# Altium project FMC_Test_Module.PrjPcb
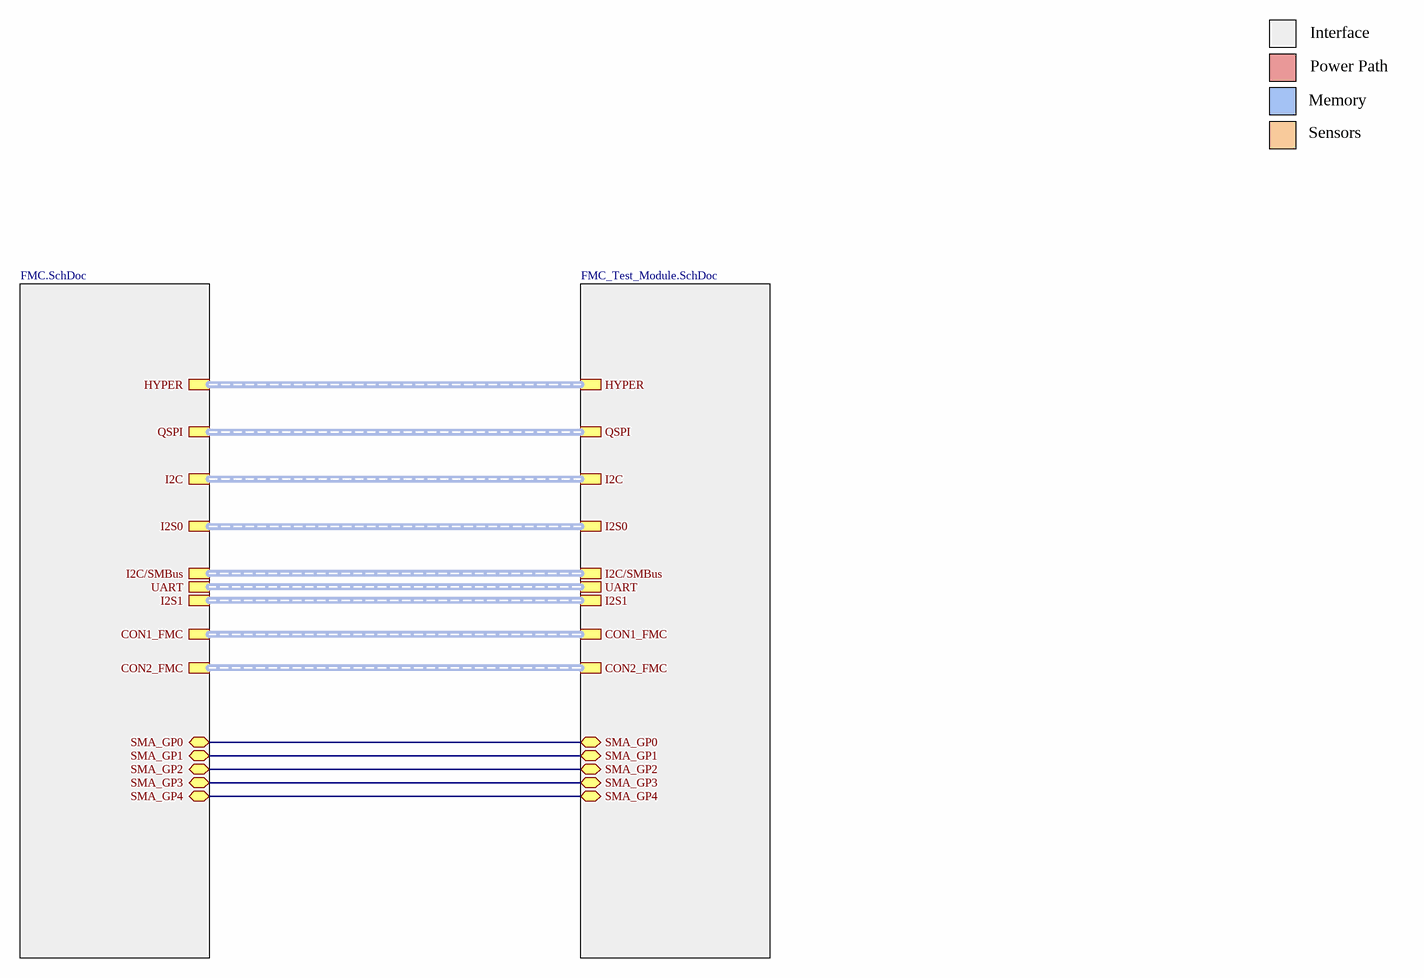
[diagram p0: FMC_Test_Module_main.SchDoc]
author: Philipp Mayer; institute: Integrated Systems Laboratory; organization: ETH Zurich; productname: FMC Test Module; version: A
3 sheets, 11 parts. Net scope: hierarchical (ports join the sheet entries above them; power ports are global).
Board file: FMC_Test_Module.PcbDoc
Sheets:
  FMC_Test_Module_main.SchDoc
    FMC = FMC.SchDoc
    TEST = FMC_Test_Module.SchDoc

## Sheet FMC_Test_Module_main.SchDoc: FMC Test Module - Main
size A3; Author: mayerph; DrawnBy: mayerph; Organization: IIS; Revision: PA; SheetNumber: 1; SheetTotal: 3

### Sub-sheets
FMC = FMC.SchDoc: HYPER, QSPI, I2C, I2S0, I2C/SMBus, UART, I2S1, CON1_FMC, CON2_FMC, SMA_GP2 (bidir), SMA_GP3 (bidir), SMA_GP0 (bidir), SMA_GP1 (bidir), SMA_GP4 (bidir)
TEST = FMC_Test_Module.SchDoc: HYPER, QSPI, I2C, I2S0, I2C/SMBus, UART, I2S1, CON1_FMC, CON2_FMC, SMA_GP3 (bidir), SMA_GP4 (bidir), SMA_GP2 (bidir), SMA_GP0 (bidir), SMA_GP1 (bidir)

### Nets
NetJ1_1: sheet FMC/SMA_GP0, sheet TEST/SMA_GP0
NetJ2_1: sheet FMC/SMA_GP1, sheet TEST/SMA_GP1
NetJ3_1: sheet FMC/SMA_GP2, sheet TEST/SMA_GP2
NetJ4_1: sheet FMC/SMA_GP3, sheet TEST/SMA_GP3
NetJ5_1: sheet FMC/SMA_GP4, sheet TEST/SMA_GP4

### Buses and harness runs
harness sheet FMC/CON1_FMC = sheet TEST/CON1_FMC
harness sheet FMC/CON2_FMC = sheet TEST/CON2_FMC
harness sheet FMC/HYPER = sheet TEST/HYPER
harness sheet FMC/I2C = sheet TEST/I2C
harness sheet FMC/I2C/SMBus = sheet TEST/I2C/SMBus
harness sheet FMC/I2S0 = sheet TEST/I2S0
harness sheet FMC/I2S1 = sheet TEST/I2S1
harness sheet FMC/QSPI = sheet TEST/QSPI
harness sheet FMC/UART = sheet TEST/UART

### Notes on the sheet
- Interface
- Memory
- Power Path
- Sensors
- 1
- 2
- 3
- 4
- 5
- 6
- 7
- 8
- A
- B
- C
- D
- Project:
- Date:
- Drawing number:
- Rev:
- Format:
- A3
- Drawn by:
- Laboratory:
- Page
- Sheet:
- of
- File:

## Sheet FMC.SchDoc: FMC Test Module - FMC
size A3; Author: mayerph; DrawnBy: mayerph; Organization: IIS; Revision: PA; SheetNumber: 2; SheetTotal: 3
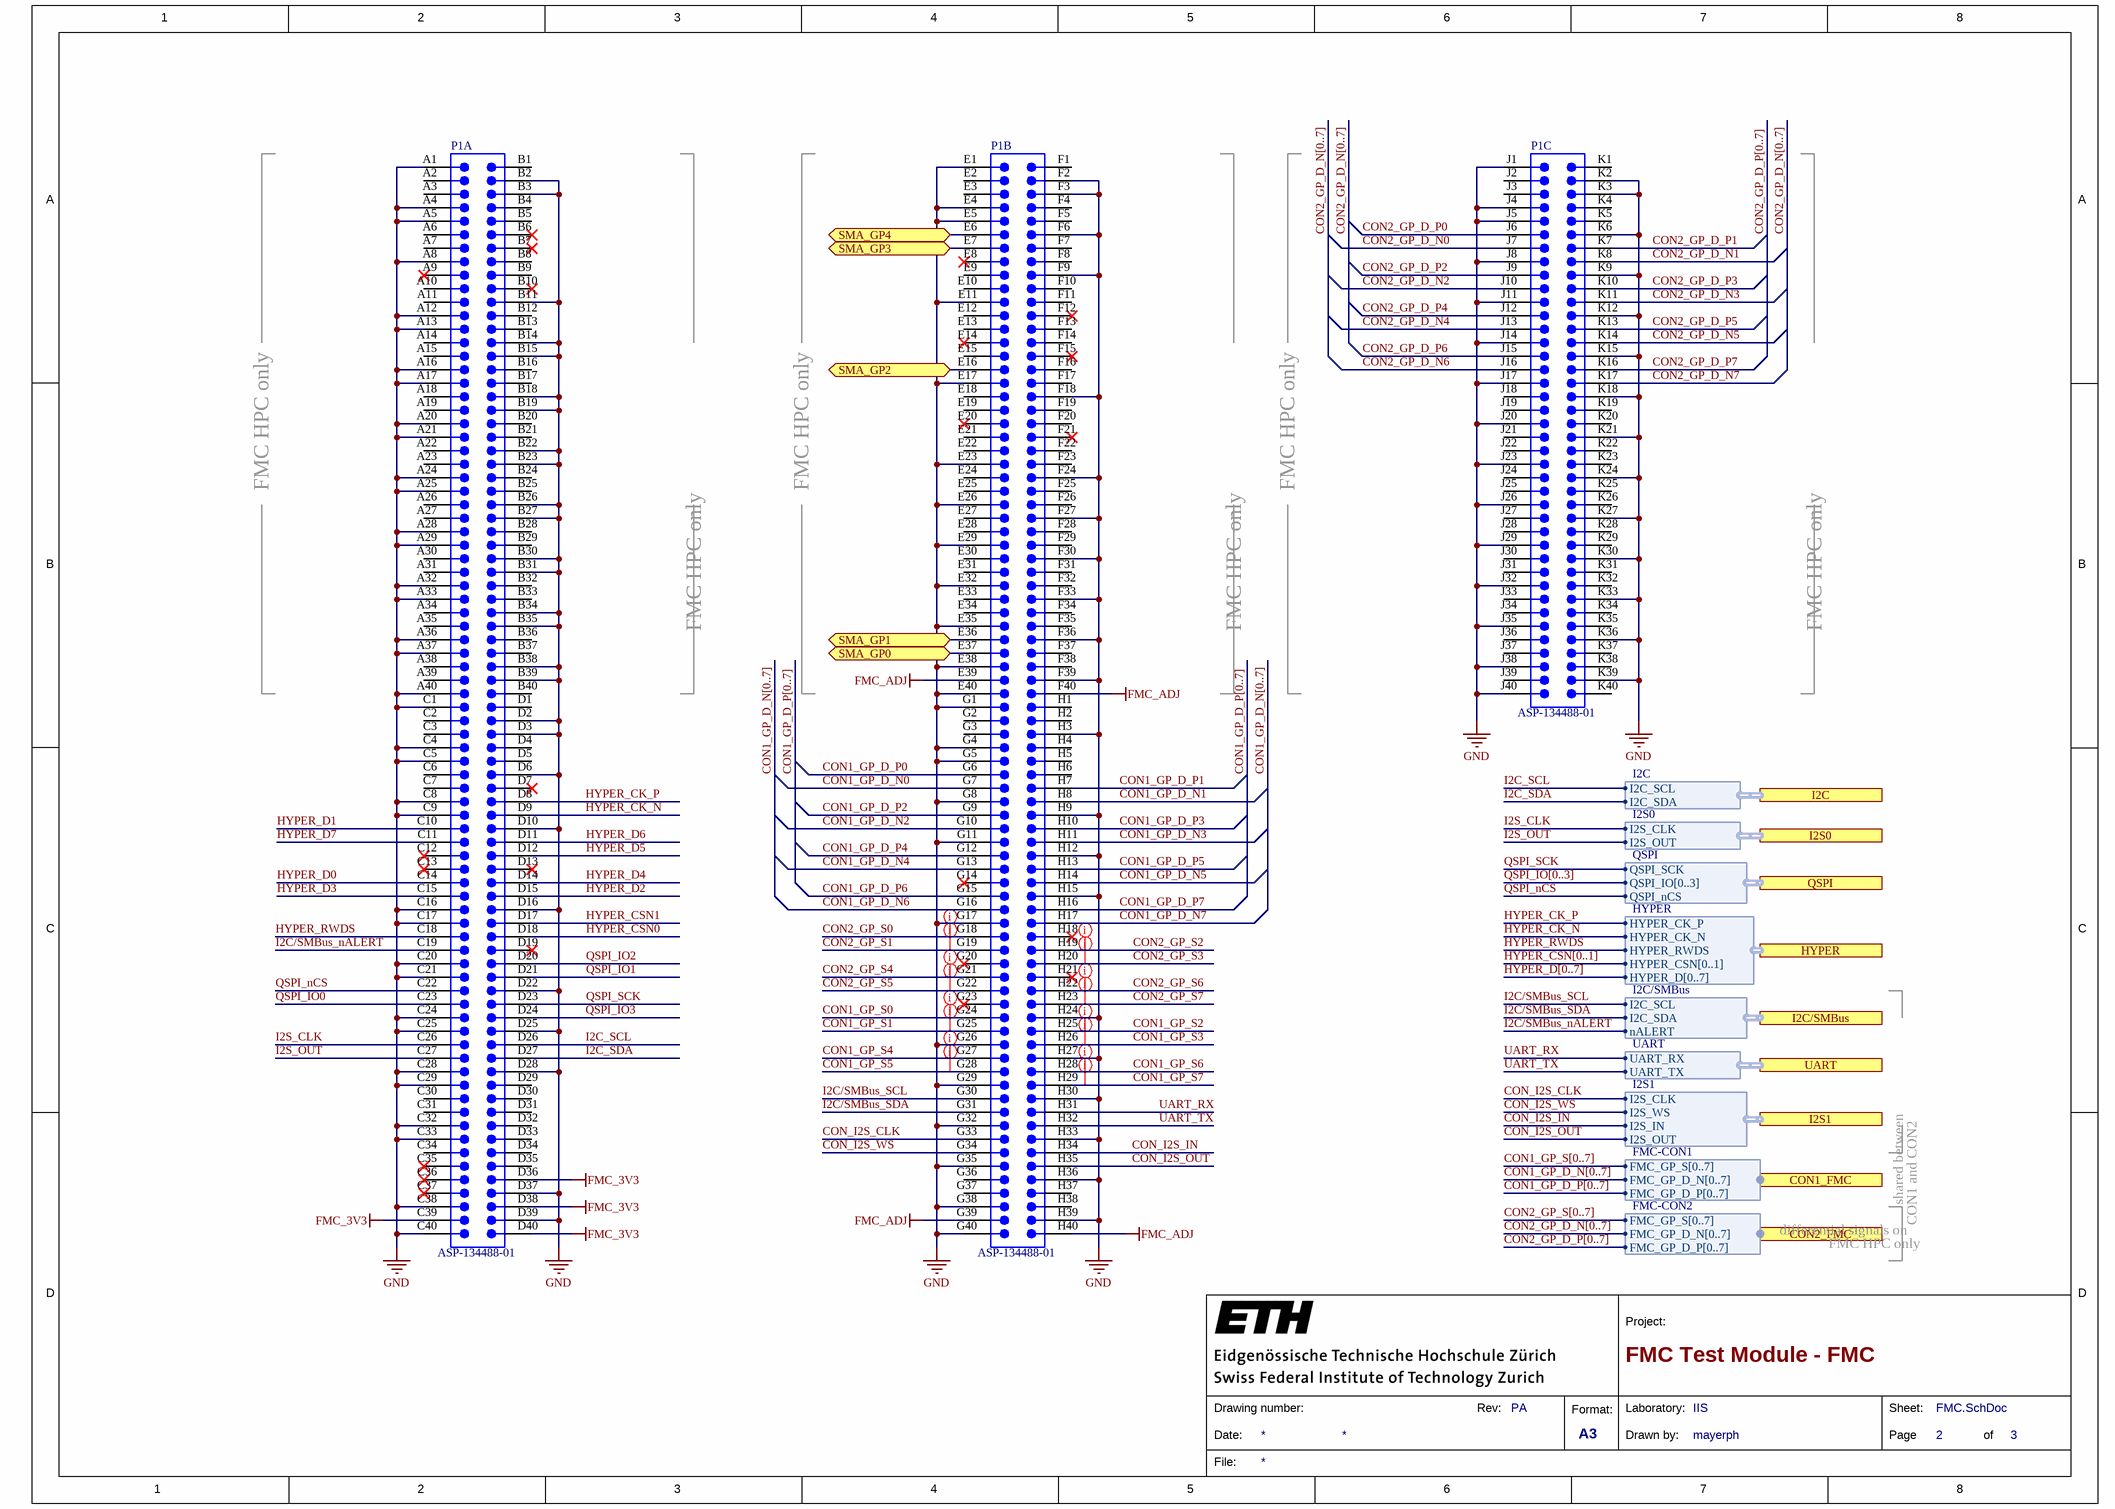
[diagram p1: FMC.SchDoc]

### Parts
P1  ASP-134488-01  [BTB-SM1-27-2V400M]  (parts A,B,C of 3)

### Ports
CON1_FMC (harness FMC-CON1), CON2_FMC (harness FMC-CON2), HYPER (harness HYPER), I2C (harness I2C), I2C/SMBus (harness I2C/SMBus), I2S0 (harness I2S0), I2S1 (harness I2S1), QSPI (harness QSPI), SMA_GP0 (bidir), SMA_GP1 (bidir), SMA_GP2 (bidir), SMA_GP3 (bidir), SMA_GP4 (bidir), UART (harness UART)

### Harnesses
I2C/SMBus: I2C_SDA, I2C_SCL, nALERT
UART: UART_TX, UART_RX
I2S1: I2S_OUT, I2S_IN, I2S_WS, I2S_CLK
FMC-CON1: FMC_GP_D_N[0..7], FMC_GP_S[0..7], FMC_GP_D_P[0..7]
I2S0: I2S_OUT, I2S_CLK
I2C: I2C_SDA, I2C_SCL
QSPI: QSPI_SCK, QSPI_IO[0..3], QSPI_nCS
HYPER: HYPER_CK_N, HYPER_CK_P, HYPER_RWDS, HYPER_CSN[0..1], HYPER_D[0..7]
FMC-CON2: FMC_GP_D_N[0..7], FMC_GP_S[0..7], FMC_GP_D_P[0..7]

### Nets
FMC_3V3: P1.C39 P1.D36 P1.D38 P1.D40
FMC_ADJ: P1.E39 P1.F40 P1.G39 P1.H40
GND: P1.A1 P1.A4 P1.A5 P1.A8 P1.A12 P1.A13 P1.A16 P1.A17 P1.A20 P1.A21 P1.A24 P1.A25 P1.A28 P1.A29 P1.A32 P1.A33 P1.A36 P1.A37 P1.A40 P1.B2 P1.B3 P1.B11 P1.B14 P1.B15 P1.B18 P1.B19 P1.B22 P1.B23 P1.B26 P1.B27 P1.B30 P1.B31 P1.B34 P1.B35 P1.B38 P1.B39 P1.C1 P1.C4 P1.C5 P1.C8 P1.C9 P1.C16 P1.C17 P1.C20 P1.C21 P1.C24 P1.C25 P1.C28 P1.C29 P1.C32 P1.C33 P1.C38 P1.C40 P1.D2 P1.D3 P1.D6 P1.D10 P1.D16 P1.D22 P1.D25 P1.D28 P1.D37 P1.D39 P1.E1 P1.E4 P1.E5 P1.E11 P1.E17 P1.E23 P1.E26 P1.E29 P1.E32 P1.E35 P1.E38 P1.E40 P1.F2 P1.F3 P1.F6 P1.F9 P1.F18 P1.F24 P1.F27 P1.F30 P1.F33 P1.F36 P1.F39 P1.G1 P1.G4 P1.G5 P1.G8 P1.G11 P1.G17 P1.G26 P1.G29 P1.G32 P1.G35 P1.G38 P1.G40 P1.H3 P1.H9 P1.H12 P1.H15 P1.H24 P1.H27 P1.H30 P1.H33 P1.H36 P1.H39 P1.J1 P1.J4 P1.J5 P1.J8 P1.J11 P1.J14 P1.J17 P1.J20 P1.J23 P1.J26 P1.J29 P1.J32 P1.J35 P1.J38 P1.J40 P1.K2 P1.K3 P1.K6 P1.K9 P1.K12 P1.K15 P1.K18 P1.K21 P1.K24 P1.K27 P1.K30 P1.K33 P1.K36 P1.K39
CON1_GP_D_N0: P1.G7
CON1_GP_D_N1: P1.H8
CON1_GP_D_N2: P1.G10
CON1_GP_D_N3: P1.H11
CON1_GP_D_N4: P1.G13
CON1_GP_D_N5: P1.H14
CON1_GP_D_N6: P1.G16
CON1_GP_D_N7: P1.H17
CON1_GP_D_P0: P1.G6
CON1_GP_D_P1: P1.H7
CON1_GP_D_P2: P1.G9
CON1_GP_D_P3: P1.H10
CON1_GP_D_P4: P1.G12
CON1_GP_D_P5: P1.H13
CON1_GP_D_P6: P1.G15
CON1_GP_D_P7: P1.H16
CON1_GP_S0: P1.G24
CON1_GP_S1: P1.G25
CON1_GP_S2: P1.H25
CON1_GP_S3: P1.H26
CON1_GP_S4: P1.G27
CON1_GP_S5: P1.G28
CON1_GP_S6: P1.H28
CON1_GP_S7: P1.H29
CON2_GP_D_N0: P1.J7
CON2_GP_D_N1: P1.K8
CON2_GP_D_N2: P1.J10
CON2_GP_D_N3: P1.K11
CON2_GP_D_N4: P1.J13
CON2_GP_D_N5: P1.K14
CON2_GP_D_N6: P1.J16
CON2_GP_D_N7: P1.K17
CON2_GP_D_P0: P1.J6
CON2_GP_D_P1: P1.K7
CON2_GP_D_P2: P1.J9
CON2_GP_D_P3: P1.K10
CON2_GP_D_P4: P1.J12
CON2_GP_D_P5: P1.K13
CON2_GP_D_P6: P1.J15
CON2_GP_D_P7: P1.K16
CON2_GP_S0: P1.G18
CON2_GP_S1: P1.G19
CON2_GP_S2: P1.H19
CON2_GP_S3: P1.H20
CON2_GP_S4: P1.G21
CON2_GP_S5: P1.G22
CON2_GP_S6: P1.H22
CON2_GP_S7: P1.H23
CON_I2S_CLK: P1.G33 ; port I2S1.I2S_CLK
CON_I2S_IN: P1.H34 ; port I2S1.I2S_IN
CON_I2S_OUT: P1.H35 ; port I2S1.I2S_OUT
CON_I2S_WS: P1.G34 ; port I2S1.I2S_WS
HYPER_CK_N: P1.D9 ; port HYPER.HYPER_CK_N
HYPER_CK_P: P1.D8 ; port HYPER.HYPER_CK_P
HYPER_CSN0: P1.D18
HYPER_CSN1: P1.D17
HYPER_D0: P1.C14
HYPER_D1: P1.C10
HYPER_D2: P1.D15
HYPER_D3: P1.C15
HYPER_D4: P1.D14
HYPER_D5: P1.D12
HYPER_D6: P1.D11
HYPER_D7: P1.C11
HYPER_RWDS: P1.C18 ; port HYPER.HYPER_RWDS
I2C/SMBus_nALERT: P1.C19 ; port I2C/SMBus.nALERT
I2C/SMBus_SCL: P1.G30 ; port I2C/SMBus.I2C_SCL
I2C/SMBus_SDA: P1.G31 ; port I2C/SMBus.I2C_SDA
I2C_SCL: P1.D26 ; port I2C.I2C_SCL
I2C_SDA: P1.D27 ; port I2C.I2C_SDA
I2S_CLK: P1.C26 ; port I2S0.I2S_CLK
I2S_OUT: P1.C27 ; port I2S0.I2S_OUT
QSPI_IO0: P1.C23
QSPI_IO1: P1.D21
QSPI_IO2: P1.D20
QSPI_IO3: P1.D24
QSPI_nCS: P1.C22 ; port QSPI.QSPI_nCS
QSPI_SCK: P1.D23 ; port QSPI.QSPI_SCK
UART_RX: P1.H31 ; port UART.UART_RX
UART_TX: P1.H32 ; port UART.UART_TX
NetJ1_1: P1.E37 ; port SMA_GP0
NetJ2_1: P1.E36 ; port SMA_GP1
NetJ3_1: P1.E16 ; port SMA_GP2
NetJ4_1: P1.E7 ; port SMA_GP3
NetJ5_1: P1.E6 ; port SMA_GP4

Not connected (* = marked no-connect by the designer): P1 A2 A3 A6 A7 A9* A10 A11 A14 A15 A18 A19 A22 A23 A26 A27 A30 A31 A34 A35 A38 A39 B1 B4 B5 B6* B7* B8 B9 B10* B12 B13 B16 B17 B20 B21 B24 B25 B28 B29 B32 B33 B36 B37 B40 C2 C3 C6 C7 C12* C13* C30 C31 C34 C35* C36* C37* D1 D4 D5 D7* D13* D19* D29 D30 D31 D32 D33 D34 D35 E2 E3 E8* E9 E10 E12 E13 E14* E15 E18 E19 E20* E21 E22 E24 E25 E27 E28 E30 E31 E33 E34 F1 F4 F5 F7 F8 F10 F11 F12* F13 F14 F15* F16 F17 F19 F20 F21* F22 F23 F25 F26 F28 F29 F31 F32 F34 F35 F37 F38 G2 G3 G14* G20* G23* G36 G37 H1 H2 H4 H5 H6 H18* H21* H37 H38 J2 J3 J18 J19 J21 J22 J24 J25 J27 J28 J30 J31 J33 J34 J36 J37 J39 K1 K4 K5 K19 K20 K22 K23 K25 K26 K28 K29 K31 K32 K34 K35 K37 K38 K40

### Buses and harness runs
bus CON1_GP_D_N[0..7]
bus CON1_GP_D_P[0..7]
bus CON1_GP_S[0..7]
bus CON2_GP_D_N[0..7]
bus CON2_GP_D_P[0..7]
bus CON2_GP_S[0..7]
bus HYPER_CSN[0..1]
bus HYPER_D[0..7]
bus QSPI_IO[0..3]

### Layout directives
net class S_FMC_MPP_CON2: CON2_GP_S0, CON2_GP_S1, CON2_GP_S2, CON2_GP_S3, CON2_GP_S4, CON2_GP_S5, CON2_GP_S6, CON2_GP_S7
net class S_FMC_MPP_CON1: CON1_GP_S0, CON1_GP_S1, CON1_GP_S2, CON1_GP_S3, CON1_GP_S4, CON1_GP_S5, CON1_GP_S6, CON1_GP_S7

### Notes on the sheet
- FMC HPC only
- shared between
- CON1 and CON2
- differential signals on
- 1
- 2
- 3
- 4
- 5
- 6
- 7
- 8
- A
- B
- C
- D
- Project:
- Date:
- Drawing number:
- Rev:
- Format:
- A3
- Drawn by:
- Laboratory:
- Page
- Sheet:
- of
- File:

### Library data of the parts
P1 = CMP-0001-00022-1: Board-to-Board Connector, Vertical, 10-Row, Pitch 1.27mm, 400-Position; Manufacturer: Samtec; Mating Connector: ASP-134486-01; Number of Contacts: 400; Gender: Male; Pitch: 0.05inch; Publisher: Altium; ClassName: Board Template Connector; Component Kind: Standard; Datasheet Version: Feb-2007; Package Reference: BTB-SM1-27-2V400M; PartId: 1; Supplier 1: Digi-Key; Supplier Part Number 1: SAM8730-ND; Manufacturer Part Number: ASP-134488-01; RoHS: Yes; Category: Connectors; Stock 1: 4276; Pricing 1: 1=27.73000, 10=25.03300, 25=23.98400, 50=22.48500, 100=21.73550, 250=20.53632, 500=19.93670, 1000=19.48700 (USD); Mount: Surface Mount; Contact Plating: Gold; Contact Material: Copper Alloy; Number of Rows: 10; Termination: SMD/SMT; Packaging: Tape and Reel; Number of Positions: 400; Series: ASP; Package Quantity: 1; Radiation Hardening: No; REACH SVHC: No SVHC; RoHS Compliant: Yes; ComponentLink1URL: https://datasheet.ciiva.com/403/asp-134488-01-403749.pdf?src-supplier=Digi-Key; ComponentLink1Description: https://datasheet.ciiva.com/403/asp-134488-01-403749.pdf?src-supplier=Digi-Key; ComponentLink2URL: https://datasheet.ciiva.com/9532/asp-134488-01-9532666.pdf?src-supplier=Avnet; ComponentLink2Description: https://datasheet.ciiva.com/9532/asp-134488-01-9532666.pdf?src-supplier=Avnet

## Sheet FMC_Test_Module.SchDoc: FMC Test Module
size A3; Author: mayerph; DrawnBy: mayerph; Organization: IIS; Revision: PA; SheetNumber: 3; SheetTotal: 3
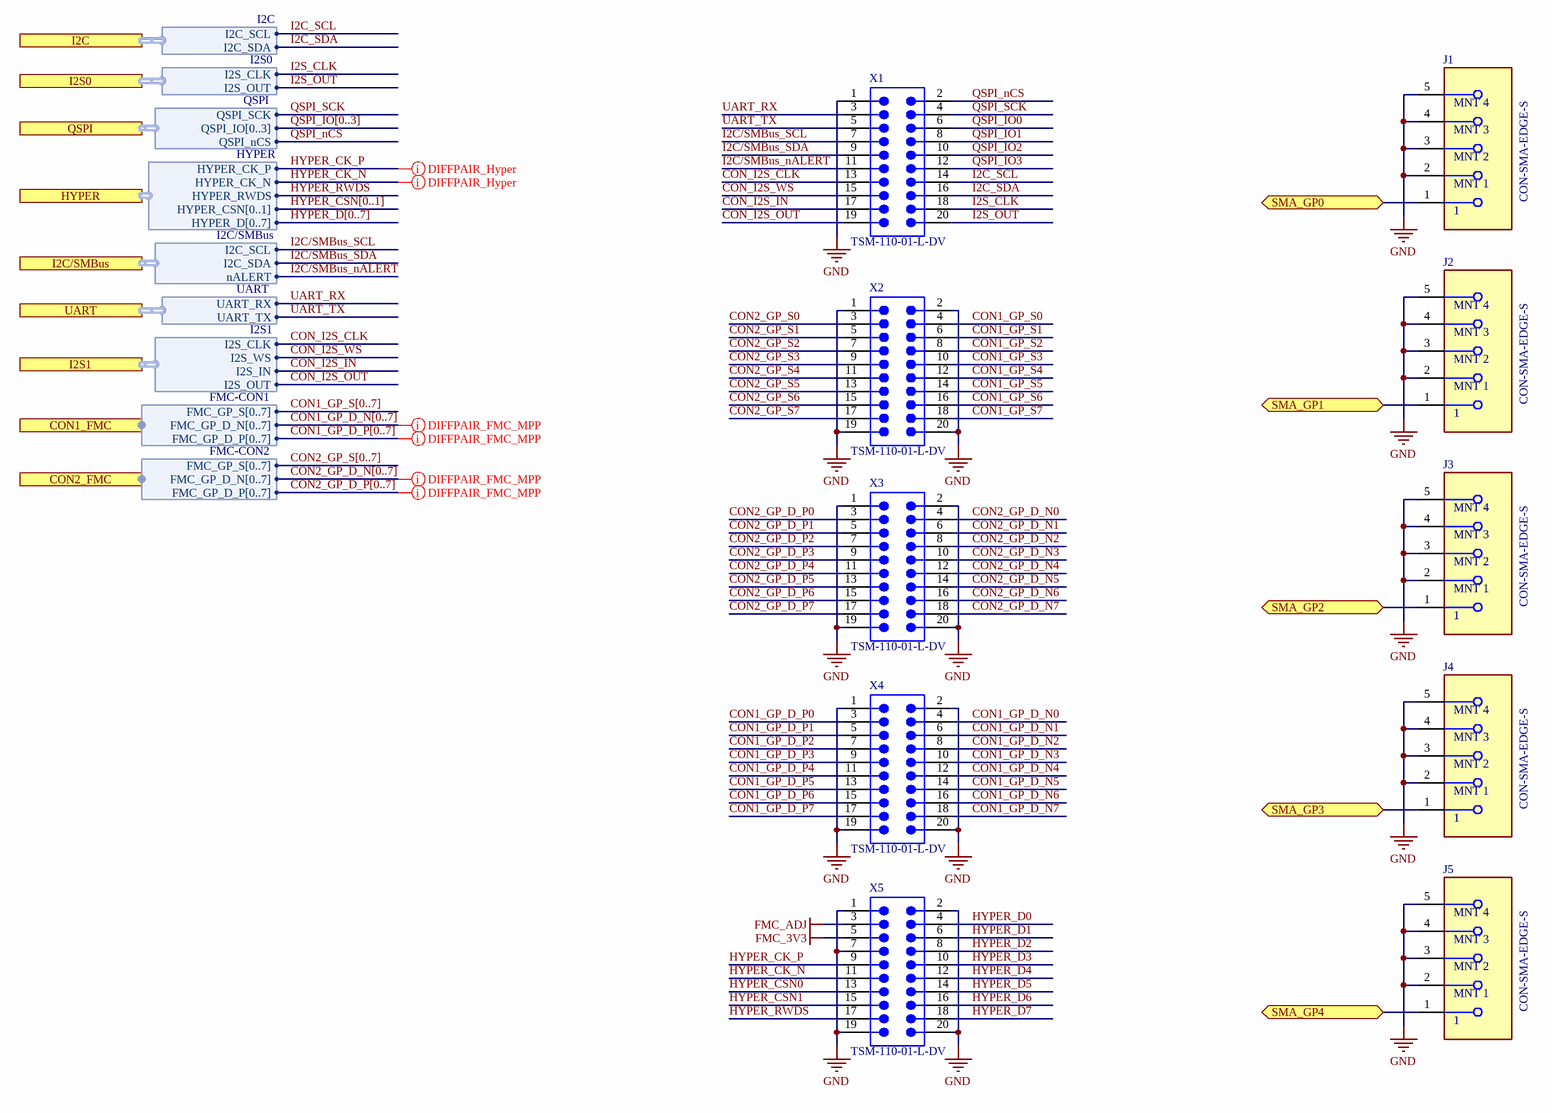
[diagram p2: FMC_Test_Module.SchDoc]

### Parts
J1  CON-SMA-EDGE-S  [FP-CON-SMA-EDGE-S-MFG]
J2  CON-SMA-EDGE-S  [FP-CON-SMA-EDGE-S-MFG]
J3  CON-SMA-EDGE-S  [FP-CON-SMA-EDGE-S-MFG]
J4  CON-SMA-EDGE-S  [FP-CON-SMA-EDGE-S-MFG]
J5  CON-SMA-EDGE-S  [FP-CON-SMA-EDGE-S-MFG]
X1  TSM-110-01-L-DV  [SMTC-TSM-110-01-X-DV]
X2  TSM-110-01-L-DV  [SMTC-TSM-110-01-X-DV]
X3  TSM-110-01-L-DV  [SMTC-TSM-110-01-X-DV]
X4  TSM-110-01-L-DV  [SMTC-TSM-110-01-X-DV]
X5  TSM-110-01-L-DV  [SMTC-TSM-110-01-X-DV]

### Ports
CON1_FMC (harness FMC-CON1), CON2_FMC (harness FMC-CON2), HYPER (harness HYPER), I2C (harness I2C), I2C/SMBus (harness I2C/SMBus), I2S0 (harness I2S0), I2S1 (harness I2S1), QSPI (harness QSPI), SMA_GP0 (bidir), SMA_GP1 (bidir), SMA_GP2 (bidir), SMA_GP3 (bidir), SMA_GP4 (bidir), UART (harness UART)

### Harnesses
I2C/SMBus: I2C_SDA, I2C_SCL, nALERT
UART: UART_TX, UART_RX
I2S1: I2S_OUT, I2S_IN, I2S_WS, I2S_CLK
FMC-CON1: FMC_GP_D_N[0..7], FMC_GP_S[0..7], FMC_GP_D_P[0..7]
I2S0: I2S_OUT, I2S_CLK
I2C: I2C_SDA, I2C_SCL
QSPI: QSPI_SCK, QSPI_IO[0..3], QSPI_nCS
HYPER: HYPER_CK_N, HYPER_CK_P, HYPER_RWDS, HYPER_CSN[0..1], HYPER_D[0..7]
FMC-CON2: FMC_GP_D_N[0..7], FMC_GP_S[0..7], FMC_GP_D_P[0..7]

### Nets
FMC_3V3: X5.5
FMC_ADJ: X5.3
GND: J1.2(MNT_1) J1.3(MNT_2) J1.4(MNT_3) J1.5(MNT_4) J2.2(MNT_1) J2.3(MNT_2) J2.4(MNT_3) J2.5(MNT_4) J3.2(MNT_1) J3.3(MNT_2) J3.4(MNT_3) J3.5(MNT_4) J4.2(MNT_1) J4.3(MNT_2) J4.4(MNT_3) J4.5(MNT_4) J5.2(MNT_1) J5.3(MNT_2) J5.4(MNT_3) J5.5(MNT_4) X1.1 X2.1 X2.2 X2.19 X2.20 X3.1 X3.2 X3.19 X3.20 X4.1 X4.2 X4.19 X4.20 X5.1 X5.2 X5.7 X5.19 X5.20
CON1_GP_D_N0: X4.4
CON1_GP_D_N1: X4.6
CON1_GP_D_N2: X4.8
CON1_GP_D_N3: X4.10
CON1_GP_D_N4: X4.12
CON1_GP_D_N5: X4.14
CON1_GP_D_N6: X4.16
CON1_GP_D_N7: X4.18
CON1_GP_D_P0: X4.3
CON1_GP_D_P1: X4.5
CON1_GP_D_P2: X4.7
CON1_GP_D_P3: X4.9
CON1_GP_D_P4: X4.11
CON1_GP_D_P5: X4.13
CON1_GP_D_P6: X4.15
CON1_GP_D_P7: X4.17
CON1_GP_S0: X2.4
CON1_GP_S1: X2.6
CON1_GP_S2: X2.8
CON1_GP_S3: X2.10
CON1_GP_S4: X2.12
CON1_GP_S5: X2.14
CON1_GP_S6: X2.16
CON1_GP_S7: X2.18
CON2_GP_D_N0: X3.4
CON2_GP_D_N1: X3.6
CON2_GP_D_N2: X3.8
CON2_GP_D_N3: X3.10
CON2_GP_D_N4: X3.12
CON2_GP_D_N5: X3.14
CON2_GP_D_N6: X3.16
CON2_GP_D_N7: X3.18
CON2_GP_D_P0: X3.3
CON2_GP_D_P1: X3.5
CON2_GP_D_P2: X3.7
CON2_GP_D_P3: X3.9
CON2_GP_D_P4: X3.11
CON2_GP_D_P5: X3.13
CON2_GP_D_P6: X3.15
CON2_GP_D_P7: X3.17
CON2_GP_S0: X2.3
CON2_GP_S1: X2.5
CON2_GP_S2: X2.7
CON2_GP_S3: X2.9
CON2_GP_S4: X2.11
CON2_GP_S5: X2.13
CON2_GP_S6: X2.15
CON2_GP_S7: X2.17
CON_I2S_CLK: X1.13 ; port I2S1.I2S_CLK
CON_I2S_IN: X1.17 ; port I2S1.I2S_IN
CON_I2S_OUT: X1.19 ; port I2S1.I2S_OUT
CON_I2S_WS: X1.15 ; port I2S1.I2S_WS
HYPER_CK_N: X5.11 ; port HYPER.HYPER_CK_N
HYPER_CK_P: X5.9 ; port HYPER.HYPER_CK_P
HYPER_CSN0: X5.13
HYPER_CSN1: X5.15
HYPER_D0: X5.4
HYPER_D1: X5.6
HYPER_D2: X5.8
HYPER_D3: X5.10
HYPER_D4: X5.12
HYPER_D5: X5.14
HYPER_D6: X5.16
HYPER_D7: X5.18
HYPER_RWDS: X5.17 ; port HYPER.HYPER_RWDS
I2C/SMBus_nALERT: X1.11 ; port I2C/SMBus.nALERT
I2C/SMBus_SCL: X1.7 ; port I2C/SMBus.I2C_SCL
I2C/SMBus_SDA: X1.9 ; port I2C/SMBus.I2C_SDA
I2C_SCL: X1.14 ; port I2C.I2C_SCL
I2C_SDA: X1.16 ; port I2C.I2C_SDA
I2S_CLK: X1.18 ; port I2S0.I2S_CLK
I2S_OUT: X1.20 ; port I2S0.I2S_OUT
QSPI_IO0: X1.6
QSPI_IO1: X1.8
QSPI_IO2: X1.10
QSPI_IO3: X1.12
QSPI_nCS: X1.2 ; port QSPI.QSPI_nCS
QSPI_SCK: X1.4 ; port QSPI.QSPI_SCK
UART_RX: X1.3 ; port UART.UART_RX
UART_TX: X1.5 ; port UART.UART_TX
NetJ1_1: J1.1 ; port SMA_GP0
NetJ2_1: J2.1 ; port SMA_GP1
NetJ3_1: J3.1 ; port SMA_GP2
NetJ4_1: J4.1 ; port SMA_GP3
NetJ5_1: J5.1 ; port SMA_GP4

### Buses and harness runs
bus CON1_GP_D_N[0..7]
bus CON1_GP_D_P[0..7]
bus CON1_GP_S[0..7]
bus CON2_GP_D_N[0..7]
bus CON2_GP_D_P[0..7]
bus CON2_GP_S[0..7]
bus HYPER_CSN[0..1]
bus HYPER_D[0..7]
bus QSPI_IO[0..3]

### Layout directives
differential pair; net class DIFFPAIR_Hyper: HYPER_CK_N, HYPER_CK_P
differential pair; net class DP_FMC_MPP_CON1: (no net found under the mark)
differential pair; net class DP_FMC_MPP_CON2: (no net found under the mark)

### Notes on the sheet
- 1
- 2
- 3
- 4
- 5
- 6
- 7
- 8
- A
- B
- C
- D
- Project:
- Date:
- Drawing number:
- Rev:
- Format:
- A3
- Drawn by:
- Laboratory:
- Page
- Sheet:
- of
- File:

### Library data of the parts
J1-J5 = CMP-204357-000001-1: CONN SMA JACK STR EDGE MNT; Manufacturer: RF Solutions Ltd.; Impedance: 50Ω; Conn Orientation: Right Angle; Is Female: yes; Number Of Contacts: 1; Frequency: 18GHz; Shielding: true; Category: Conn; ComponentLink2URL: https://www.rfsolutions.co.uk/downloads/1498648656DS-CON-EDGE-SMA-4.pdf; Octopart: https://octopart.com/con-sma-edge-s-rf+solutions-70967450; Package: CONN_JACK; Manufacturer Part Number: CON-SMA-EDGE-S; Height: 6.35mm; Device Class L1: Connectors; Footprint Url: https://forum.upverter.com/uploads/default/original/3X/b/e/be75b907af57498775929d6d9099689c472e0307.pdf; Contact Material: Gold; ComponentLink2Description: Datasheet; Device Class L2: RF / Coaxial Connectors; RoHS: TRUE; Device Class L3: unset; Digikey Description: CONN SMA JACK STR EDGE MNT; Lead Free: Yes; Automotive: No
X1-X5 = CMP-1024-00285-1: 0.025" SQ Post Header, Surface Mount, Vertical, -55 to 125 degC, 2.54 mm Pitch, 20-Pin, Male, RoHS; Manufacturer: Samtec; Pitch: 2.54 mm; Number of Positions: 20; Connector Type: Male Pin; Current Rating: 7A; Voltage Rating: 475V; Row Spacing: 0.1inch; PackageReference: TSM-110-01-X-DV; PackageDescription: Double Row Gullwing ASM; ComponentLink3Description: Package Specification; ComponentLink3URL: http://www.samtec.com/documents/webfiles/cpdf/TSM-1XX-XX-XXX-XX-X-XXX-X-MKT.pdf; DatasheetVersion: F-214; ComponentLink2Description: Datasheet; PartNumber: TSM-110-01-L-DV; Temperature Range: -55 to 125 degC; Orientation: Vertical; ComponentLink1URL: http://www.samtec.com; Mounting Technology: Surface Mount; ComponentLink1Description: Manufacturer URL; ComponentLink2URL: http://www.samtec.com/documents/webfiles/pdf/TSM.PDF; RoHS: True; PackageVersion: DJ, 4/1991; Supplier 1: Digi-Key; Supplier Part Number 1: SAM10819-ND; Manufacturer Part Number: TSM-110-01-L-DV; Category: Headers and Wire Housings; Stock 1: 159; Pricing 1: 1=2.18000, 10=1.97700, 100=1.69470, 500=1.41226, 1000=1.21050, 5000=1.07331, 10000=1.04910 (USD); Contact Plating: Gold; Contact Material: Bronze; Housing Material: Polymer; Color: Black; Housing Color: Black; Min Operating Temperature: -55°C; Max Operating Temperature: 125°C; Termination: Solder; Number of Rows: 2; Packaging: Bulk; Number of Contacts: 20; Gender: Male; Package Quantity: 1; Max Current Rating: 7A; Max Voltage Rating (AC): 475V; Length: 25.4mm; Depth: 5.08mm; Contact Mating Length: 0.23inch; Radiation Hardening: No; REACH SVHC: No SVHC; Lead Free: Lead Free; ComponentLink4URL: https://datasheet.ciiva.com/25616/0900766b81157e6c-25616960.pdf?src-supplier=RSComponents; ComponentLink4Description: https://datasheet.ciiva.com/25616/0900766b81157e6c-25616960.pdf?src-supplier=RSComponents; ComponentLink5URL: https://datasheet.ciiva.com/22677/1847330-22677900.pdf?src-supplier=Element14; ComponentLink5Description: https://datasheet.ciiva.com/22677/1847330-22677900.pdf?src-supplier=Element14; ComponentLink6URL: https://datasheet.ciiva.com/737/tsm-1xx-xx-xxx-xx-x-xxx-x-mkt-737871.pdf?src-supplier=Digi-Key; ComponentLink6Description: https://datasheet.ciiva.com/737/tsm-1xx-xx-xxx-xx-x-xxx-x-mkt-737871.pdf?src-supplier=Digi-Key

## Nets that join several sheets
FMC_3V3: FMC (P1.C39 P1.D36 P1.D38 P1.D40), FMC_Test_Module (X5.5)
FMC_ADJ: FMC (P1.E39 P1.F40 P1.G39 P1.H40), FMC_Test_Module (X5.3)
GND: FMC (137 pins), FMC_Test_Module (38 pins)
CON1_GP_D_N0: FMC (P1.G7), FMC_Test_Module (X4.4)
CON1_GP_D_N1: FMC (P1.H8), FMC_Test_Module (X4.6)
CON1_GP_D_N2: FMC (P1.G10), FMC_Test_Module (X4.8)
CON1_GP_D_N3: FMC (P1.H11), FMC_Test_Module (X4.10)
CON1_GP_D_N4: FMC (P1.G13), FMC_Test_Module (X4.12)
CON1_GP_D_N5: FMC (P1.H14), FMC_Test_Module (X4.14)
CON1_GP_D_N6: FMC (P1.G16), FMC_Test_Module (X4.16)
CON1_GP_D_N7: FMC (P1.H17), FMC_Test_Module (X4.18)
CON1_GP_D_P0: FMC (P1.G6), FMC_Test_Module (X4.3)
CON1_GP_D_P1: FMC (P1.H7), FMC_Test_Module (X4.5)
CON1_GP_D_P2: FMC (P1.G9), FMC_Test_Module (X4.7)
CON1_GP_D_P3: FMC (P1.H10), FMC_Test_Module (X4.9)
CON1_GP_D_P4: FMC (P1.G12), FMC_Test_Module (X4.11)
CON1_GP_D_P5: FMC (P1.H13), FMC_Test_Module (X4.13)
CON1_GP_D_P6: FMC (P1.G15), FMC_Test_Module (X4.15)
CON1_GP_D_P7: FMC (P1.H16), FMC_Test_Module (X4.17)
CON1_GP_S0: FMC (P1.G24), FMC_Test_Module (X2.4)
CON1_GP_S1: FMC (P1.G25), FMC_Test_Module (X2.6)
CON1_GP_S2: FMC (P1.H25), FMC_Test_Module (X2.8)
CON1_GP_S3: FMC (P1.H26), FMC_Test_Module (X2.10)
CON1_GP_S4: FMC (P1.G27), FMC_Test_Module (X2.12)
CON1_GP_S5: FMC (P1.G28), FMC_Test_Module (X2.14)
CON1_GP_S6: FMC (P1.H28), FMC_Test_Module (X2.16)
CON1_GP_S7: FMC (P1.H29), FMC_Test_Module (X2.18)
CON2_GP_D_N0: FMC (P1.J7), FMC_Test_Module (X3.4)
CON2_GP_D_N1: FMC (P1.K8), FMC_Test_Module (X3.6)
CON2_GP_D_N2: FMC (P1.J10), FMC_Test_Module (X3.8)
CON2_GP_D_N3: FMC (P1.K11), FMC_Test_Module (X3.10)
CON2_GP_D_N4: FMC (P1.J13), FMC_Test_Module (X3.12)
CON2_GP_D_N5: FMC (P1.K14), FMC_Test_Module (X3.14)
CON2_GP_D_N6: FMC (P1.J16), FMC_Test_Module (X3.16)
CON2_GP_D_N7: FMC (P1.K17), FMC_Test_Module (X3.18)
CON2_GP_D_P0: FMC (P1.J6), FMC_Test_Module (X3.3)
CON2_GP_D_P1: FMC (P1.K7), FMC_Test_Module (X3.5)
CON2_GP_D_P2: FMC (P1.J9), FMC_Test_Module (X3.7)
CON2_GP_D_P3: FMC (P1.K10), FMC_Test_Module (X3.9)
CON2_GP_D_P4: FMC (P1.J12), FMC_Test_Module (X3.11)
CON2_GP_D_P5: FMC (P1.K13), FMC_Test_Module (X3.13)
CON2_GP_D_P6: FMC (P1.J15), FMC_Test_Module (X3.15)
CON2_GP_D_P7: FMC (P1.K16), FMC_Test_Module (X3.17)
CON2_GP_S0: FMC (P1.G18), FMC_Test_Module (X2.3)
CON2_GP_S1: FMC (P1.G19), FMC_Test_Module (X2.5)
CON2_GP_S2: FMC (P1.H19), FMC_Test_Module (X2.7)
CON2_GP_S3: FMC (P1.H20), FMC_Test_Module (X2.9)
CON2_GP_S4: FMC (P1.G21), FMC_Test_Module (X2.11)
CON2_GP_S5: FMC (P1.G22), FMC_Test_Module (X2.13)
CON2_GP_S6: FMC (P1.H22), FMC_Test_Module (X2.15)
CON2_GP_S7: FMC (P1.H23), FMC_Test_Module (X2.17)
CON_I2S_CLK: FMC (P1.G33), FMC_Test_Module (X1.13)
CON_I2S_IN: FMC (P1.H34), FMC_Test_Module (X1.17)
CON_I2S_OUT: FMC (P1.H35), FMC_Test_Module (X1.19)
CON_I2S_WS: FMC (P1.G34), FMC_Test_Module (X1.15)
HYPER_CK_N: FMC (P1.D9), FMC_Test_Module (X5.11)
HYPER_CK_P: FMC (P1.D8), FMC_Test_Module (X5.9)
HYPER_CSN0: FMC (P1.D18), FMC_Test_Module (X5.13)
HYPER_CSN1: FMC (P1.D17), FMC_Test_Module (X5.15)
HYPER_D0: FMC (P1.C14), FMC_Test_Module (X5.4)
HYPER_D1: FMC (P1.C10), FMC_Test_Module (X5.6)
HYPER_D2: FMC (P1.D15), FMC_Test_Module (X5.8)
HYPER_D3: FMC (P1.C15), FMC_Test_Module (X5.10)
HYPER_D4: FMC (P1.D14), FMC_Test_Module (X5.12)
HYPER_D5: FMC (P1.D12), FMC_Test_Module (X5.14)
HYPER_D6: FMC (P1.D11), FMC_Test_Module (X5.16)
HYPER_D7: FMC (P1.C11), FMC_Test_Module (X5.18)
HYPER_RWDS: FMC (P1.C18), FMC_Test_Module (X5.17)
I2C/SMBus_nALERT: FMC (P1.C19), FMC_Test_Module (X1.11)
I2C/SMBus_SCL: FMC (P1.G30), FMC_Test_Module (X1.7)
I2C/SMBus_SDA: FMC (P1.G31), FMC_Test_Module (X1.9)
I2C_SCL: FMC (P1.D26), FMC_Test_Module (X1.14)
I2C_SDA: FMC (P1.D27), FMC_Test_Module (X1.16)
I2S_CLK: FMC (P1.C26), FMC_Test_Module (X1.18)
I2S_OUT: FMC (P1.C27), FMC_Test_Module (X1.20)
NetJ1_1: FMC (P1.E37), FMC_Test_Module (J1.1)
NetJ2_1: FMC (P1.E36), FMC_Test_Module (J2.1)
NetJ3_1: FMC (P1.E16), FMC_Test_Module (J3.1)
NetJ4_1: FMC (P1.E7), FMC_Test_Module (J4.1)
NetJ5_1: FMC (P1.E6), FMC_Test_Module (J5.1)
QSPI_IO0: FMC (P1.C23), FMC_Test_Module (X1.6)
QSPI_IO1: FMC (P1.D21), FMC_Test_Module (X1.8)
QSPI_IO2: FMC (P1.D20), FMC_Test_Module (X1.10)
QSPI_IO3: FMC (P1.D24), FMC_Test_Module (X1.12)
QSPI_nCS: FMC (P1.C22), FMC_Test_Module (X1.2)
QSPI_SCK: FMC (P1.D23), FMC_Test_Module (X1.4)
UART_RX: FMC (P1.H31), FMC_Test_Module (X1.3)
UART_TX: FMC (P1.H32), FMC_Test_Module (X1.5)